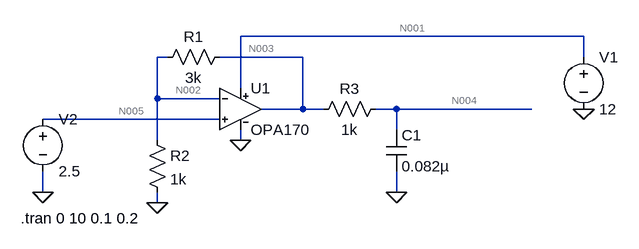
[diagram p0: schematic Analog_OUT_0-10V.asc]
Analog_OUT_0-10V.asc, the LTspice schematic file:
Version 4
SHEET 1 880 680
WIRE 704 64 176 64
WIRE 64 96 48 96
WIRE 272 96 144 96
WIRE 704 96 704 64
WIRE 176 144 176 64
WIRE 48 160 48 96
WIRE 144 160 48 160
WIRE 272 176 272 96
WIRE 272 176 208 176
WIRE 304 176 272 176
WIRE 416 176 384 176
WIRE 624 176 416 176
WIRE 144 192 -128 192
WIRE 416 208 416 176
WIRE 48 224 48 160
WIRE 176 224 176 208
WIRE -128 304 -128 272
WIRE 416 304 416 272
WIRE 48 320 48 304
FLAG 176 224 0
FLAG 704 176 0
FLAG 48 320 0
FLAG -128 304 0
FLAG 416 304 0
SYMBOL Opamps\\OPA170 176 112 R0
SYMATTR InstName U1
SYMBOL voltage 704 80 R0
WINDOW 123 0 0 Left 2
WINDOW 39 0 0 Left 2
SYMATTR InstName V1
SYMATTR Value 12
SYMBOL res 160 80 R90
WINDOW 0 0 56 VBottom 2
WINDOW 3 32 56 VTop 2
SYMATTR InstName R1
SYMATTR Value 3k
SYMBOL res 32 208 R0
SYMATTR InstName R2
SYMATTR Value 1k
SYMBOL voltage -128 176 R0
WINDOW 123 24 124 Left 2
WINDOW 39 0 0 Left 2
SYMATTR InstName V2
SYMATTR Value 2.5
SYMBOL res 400 160 R90
WINDOW 0 0 56 VBottom 2
WINDOW 3 32 56 VTop 2
SYMATTR InstName R3
SYMATTR Value 1k
SYMBOL cap 400 208 R0
SYMATTR InstName C1
SYMATTR Value 0.082µ
TEXT -162 344 Left 2 !.tran 0 10 0.1 0.2

The netlist it stands for:
* Analog_OUT_0-10V.asc
XU1 N002 N005 0 N001 N003 OPA170  ; pins In- In+ V- V+ OUT
V1 N001 0 12
R1 N003 N002 3k
R2 N002 0 1k
V2 N005 0 2.5
R3 N004 N003 1k
C1 N004 0 0.082µ
.tran 0 10 0.1 0.2
.lib OPA170.sub
.backanno
.end

* Results of the author's LTspice run, read from the files saved beside the schematic
* Operating Point, zero values left out:
*   V(n001) = 12 V
*   V(n005) = 2.5 V
*   V(n002) = 1.49 V
*   V(n003) = 5.962 V
*   V(n004) = 5.962 V
*   I(R2) = 1.49 mA
*   I(R1) = 1.49 mA
*   I(V2) = 14.6 pA
*   I(V1) = -12 kA
*   Ix(u1:-IN) = -12.78 pA
*   Ix(u1:+IN) = -14.6 pA
*   Ix(u1:V-) = -12 kA
*   Ix(u1:V+) = 12 kA
*   Ix(u1:VOUT) = -1.49 mA
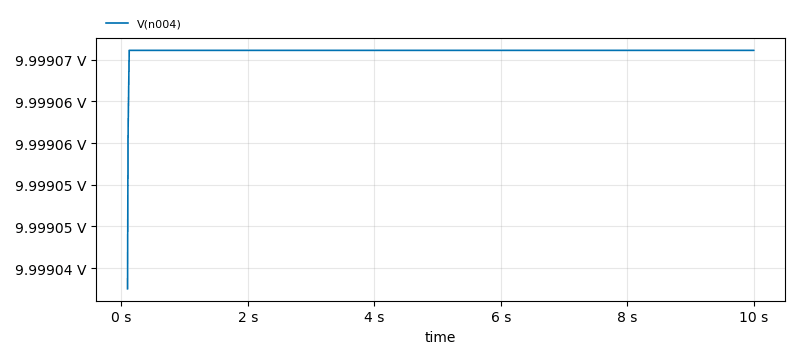
[diagram p1: Transient Analysis of Analog_OUT_0-10V.asc, plotted from the saved traces]
* Transient Analysis, 1 run:
*   V(n004): min 9.999 V, max 9.999 V, average 9.999 V, rms 9.999 V, last 9.999 V